# Altium schematic sheet 2_PWR.schdoc.schdoc
size 431 x 309 mm; Symbol: Sheet-Symbol_A3; Device: Sheet-Symbol_A3; Company: 嘉立创EDA; Version: V1.0; Page Size: A3; @Project Name: V3S_LCD; @Page Count: 4; @Update Date: 2023-12-17; @Create Date: 2023-12-14; @Schematic Name: Schematic1; @Page No: 2; @Page Name: PWR
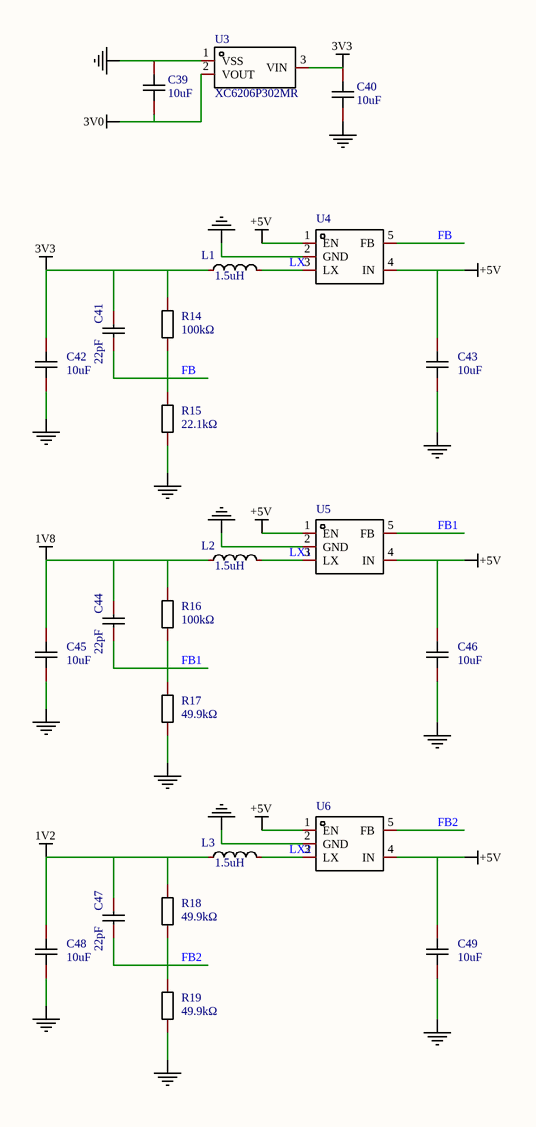
[diagram p0: 2_PWR.schdoc.schdoc]

## Parts
C39  10uF  [C0603]
C40  10uF  [C0603]
C41  22pF  [C0603]
C42  10uF  [C0603]
C43  10uF  [C0603]
C44  22pF  [C0603]
C45  10uF  [C0603]
C46  10uF  [C0603]
C47  22pF  [C0603]
C48  10uF  [C0603]
C49  10uF  [C0603]
L1  1.5uH  [IND-SMD_L2.5-W2.0_YXMBL252010P]
L2  1.5uH  [IND-SMD_L2.5-W2.0_YXMBL252010P]
L3  1.5uH  [IND-SMD_L2.5-W2.0_YXMBL252010P]
R14  100kΩ  [R0603]
R15  22.1kΩ  [R0603]
R16  100kΩ  [R0603]
R17  49.9kΩ  [R0603]
R18  49.9kΩ  [R0603]
R19  49.9kΩ  [R0603]
U3  XC6206P302MR  [SOT-23-3_L3.0-W1.7-P0.95-LS2.9-BR]
U4  SY8089A1AAC  [TSOT-23-5_L2.9-W1.6-P0.95-LS2.8-BR]  (value not drawn)
U5  SY8089A1AAC  [TSOT-23-5_L2.9-W1.6-P0.95-LS2.8-BR]  (value not drawn)
U6  SY8089A1AAC  [TSOT-23-5_L2.9-W1.6-P0.95-LS2.8-BR]  (value not drawn)

## Nets
1V2: C47.2 C48.2 L3.1 R18.2
1V8: C44.2 C45.2 L2.1 R16.2
3V0: C39.1 U3.2(VOUT)
3V3: C40.2 C41.2 C42.2 L1.1 R14.2 U3.3(VIN)
+5V: C43.2 C46.2 C49.2 U4.1(EN) U4.4(IN) U5.1(EN) U5.4(IN) U6.1(EN) U6.4(IN)
GND: C42.1 C43.1 C45.1 C46.1 C48.1 C49.1 R15.1 R17.1 R19.1 U4.2(GND) U5.2(GND) U6.2(GND)
NetC39_2: C39.2 C40.1 U3.1(VSS)
FB: C41.1 R14.1 R15.2 U4.5(FB)
FB1: C44.1 R16.1 R17.2 U5.5(FB)
FB2: C47.1 R18.1 R19.2 U6.5(FB)
LX: L1.2 U4.3(LX)
LX1: L2.2 U5.3(LX)
LX2: L3.2 U6.3(LX)

## Notes on the sheet
- 1
- 2
- 3
- 4
- 5
- 6
- A
- B
- C
- 原理图
- Schematic1
- 创建日期
- 更新日期
- 2023-12-17
- 2023-12-14
- D
- 审阅
- 绘制
- 图页
- PWR
- 物料编码
- V3S_LCD
- 版本
- 尺寸
- 页
- 共
- V1.0
- A3
- 嘉立创EDA

## Library data of the parts
C39 C40 C42 C43 C45 C46 C48 C49 = CL10A106KP8NNNC: Manufacturer: SAMSUNG(三星); Add into BOM: yes; Tolerance: ±10%; Voltage Rated: 10V; Temperature Coefficient: X5R; Description: 容值:10uF;精度:±10%;额定电压:10V;材质(温度系数):X5R;; Name: 10uF; Symbol: CL10A106KP8NNNC; Device: CL10A106KP8NNNC; Supplier: LCSC; Manufacturer Part: CL10A106KP8NNNC; Value: 10uF; Supplier Part: C19702; JLCPCB Part Class: Basic Part; LCSC Part Name: 10uF ±10% 10V; Supplier Footprint: 0603; Datasheet: https://atta.szlcsc.com/upload/public/pdf/source/20160103/1457707703378.pdf; Convert to PCB: yes
C41 C44 C47 = CL10C220JB8NNNC: Manufacturer: SAMSUNG(三星); Add into BOM: yes; Tolerance: ±5%; Voltage Rated: 50V; Temperature Coefficient: C0G; Description: 容值:22pF;精度:±5%;额定电压:50V;材质(温度系数):C0G;; Name: 22pF; Symbol: CL10C220JB8NNNC; Device: CL10C220JB8NNNC; Supplier: LCSC; Manufacturer Part: CL10C220JB8NNNC; Value: 22pF; Supplier Part: C1653; JLCPCB Part Class: Basic Part; LCSC Part Name: 22pF ±5% 50V; Supplier Footprint: 0603; Datasheet: https://atta.szlcsc.com/upload/public/pdf/source/20160218/1457707763339.pdf; Convert to PCB: yes
L1-L3 = PIM252010-1R5MTS00: Manufacturer: FH(风华); Add into BOM: yes; Tolerance: ±20%; Rated Current: 3A; DC Resistance (DCR): 55mΩ; Description: 类型:-;电感值:1.5uH;精度:±20%;额定电流:3A;饱和电流(Isat):-;; Name: 1.5uH; Symbol: PIM252010-1R5MTS00; Device: PIM252010-1R5MTS00; LCSC Part Name: 1.5uH ±20% 3A 55mΩ; Supplier Part: C2986791; Manufacturer Part: PIM252010-1R5MTS00; Supplier Footprint: SMD,2.5x2x1mm; JLCPCB Part Class: Extended Part; Datasheet: https://atta.szlcsc.com/upload/public/pdf/source/20220412/F9C223B3E3BB425973BA14529C55B246.pdf; Supplier: LCSC; Convert to PCB: yes; Type: -; Value: 1.5uH; Saturation Current (Isat): -; Ratings: -
R14 R16 = 0603WAF1003T5E: Manufacturer: UNI-ROYAL(厚声); Add into BOM: yes; Tolerance: ±1%; Power(Watts): 100mW; Overload Voltage (Max): 75V; Temperature Coefficient: ±100ppm/℃; Description: 阻值:100kΩ;精度:±1%;功率:100mW;温度系数:±100ppm/℃;电阻类型:厚膜电阻;; Name: 100kΩ; Symbol: 0603WAF1003T5E; Device: 0603WAF1003T5E; Supplier: LCSC; Manufacturer Part: 0603WAF1003T5E; Supplier Part: C25803; Value: 100kΩ; JLCPCB Part Class: Basic Part; LCSC Part Name: 100kΩ ±1% 100mW 厚膜电阻; Supplier Footprint: 0603; Datasheet: https://atta.szlcsc.com/upload/public/pdf/source/20200306/C422600_1E6D84923E4A46A82E41ADD87F860B5C.pdf; Convert to PCB: yes; Type: 厚膜电阻; Operating Temperature Range: -55℃~+155℃
R15 = 0603WAF2212T5E: Manufacturer: UNI-ROYAL(厚声); Add into BOM: yes; Tolerance: ±1%; Power(Watts): 100mW; Overload Voltage (Max): 75V; Temperature Coefficient: ±100ppm/℃; Description: 阻值:22.1kΩ;精度:±1%;功率:100mW;温度系数:±100ppm/℃;电阻类型:厚膜电阻;; Name: 22.1kΩ; Symbol: 0603WAF2212T5E; Device: 0603WAF2212T5E; Supplier: LCSC; Manufacturer Part: 0603WAF2212T5E; Supplier Part: C25961; Value: 22.1kΩ; JLCPCB Part Class: Extended Part; LCSC Part Name: 22.1kΩ ±1% 100mW 厚膜电阻; Supplier Footprint: 0603; Datasheet: https://atta.szlcsc.com/upload/public/pdf/source/20200306/C422600_1E6D84923E4A46A82E41ADD87F860B5C.pdf; Convert to PCB: yes; Type: 厚膜电阻; Operating Temperature Range: -55℃~+155℃
R17-R19 = 0603WAF4992T5E: Manufacturer: UNI-ROYAL(厚声); Add into BOM: yes; Tolerance: ±1%; Power(Watts): 100mW; Overload Voltage (Max): 75V; Temperature Coefficient: ±100ppm/℃; Description: 阻值:49.9kΩ;精度:±1%;功率:100mW;温度系数:±100ppm/℃;电阻类型:厚膜电阻;; Name: 49.9kΩ; Symbol: 0603WAF4992T5E; Device: 0603WAF4992T5E; Supplier: LCSC; Manufacturer Part: 0603WAF4992T5E; Supplier Part: C23184; Value: 49.9kΩ; JLCPCB Part Class: Basic Part; LCSC Part Name: 49.9kΩ ±1% 100mW 厚膜电阻; Supplier Footprint: 0603; Datasheet: https://atta.szlcsc.com/upload/public/pdf/source/20200306/C422600_1E6D84923E4A46A82E41ADD87F860B5C.pdf; Convert to PCB: yes; Type: 厚膜电阻; Operating Temperature Range: -55℃~+155℃
U3 = XC6206P302MR_C347375: Manufacturer: UMW(友台半导体); Add into BOM: yes; Output Type: 固定; Output Polarity: 正; Number of Outputs: 1; Maximum Input Voltage: 8V; Output Voltage: 3V; Dropout Voltage: 240mV@(50mA); Output Current: 250mA; Power Supply Rejection Ratio (PSRR): 40dB@(1kHz); Description: 输出类型:固定;输出极性:正;最大输入电压:8V;输出电压:3V;输出电流:250mA;电源纹波抑制比(PSRR):40dB@(1kHz);; Name: XC6206P302MR; Symbol: XC6206P302MR_C347375; Device: XC6206P302MR_C347375; Supplier: LCSC; Supplier Part: C347375; Manufacturer Part: XC6206P302MR; JLCPCB Part Class: 扩展库; LCSC Part Name: 输入8V 输出3V 250mA; Supplier Footprint: SOT-23(TO-236); Datasheet: https://atta.szlcsc.com/upload/public/pdf/source/20211011/2FF0EF86CD1346BC1578534D6C1D0E45.pdf; Convert to PCB: yes; Quiescent Current (Ground Current): -; Noise: -; Feature: -; Operating Temperature: -25℃~+80℃
U4-U6 = SY8089A1AAC: Manufacturer: silergy(矽力杰); Add into BOM: yes; Name: SY8089A1AAC; Symbol: SY8089A1AAC; Device: SY8089A1AAC; LCSC Part Name: SY8089A1AAC; Supplier Part: C479074; Manufacturer Part: SY8089A1AAC; Supplier Footprint: SOT-23-5; JLCPCB Part Class: Extended Part; Datasheet: https://atta.szlcsc.com/upload/public/pdf/source/20200117/C479074_09E605B8BDE11DB5A08573B7E6429A0D.pdf; Supplier: LCSC; Convert to PCB: yes